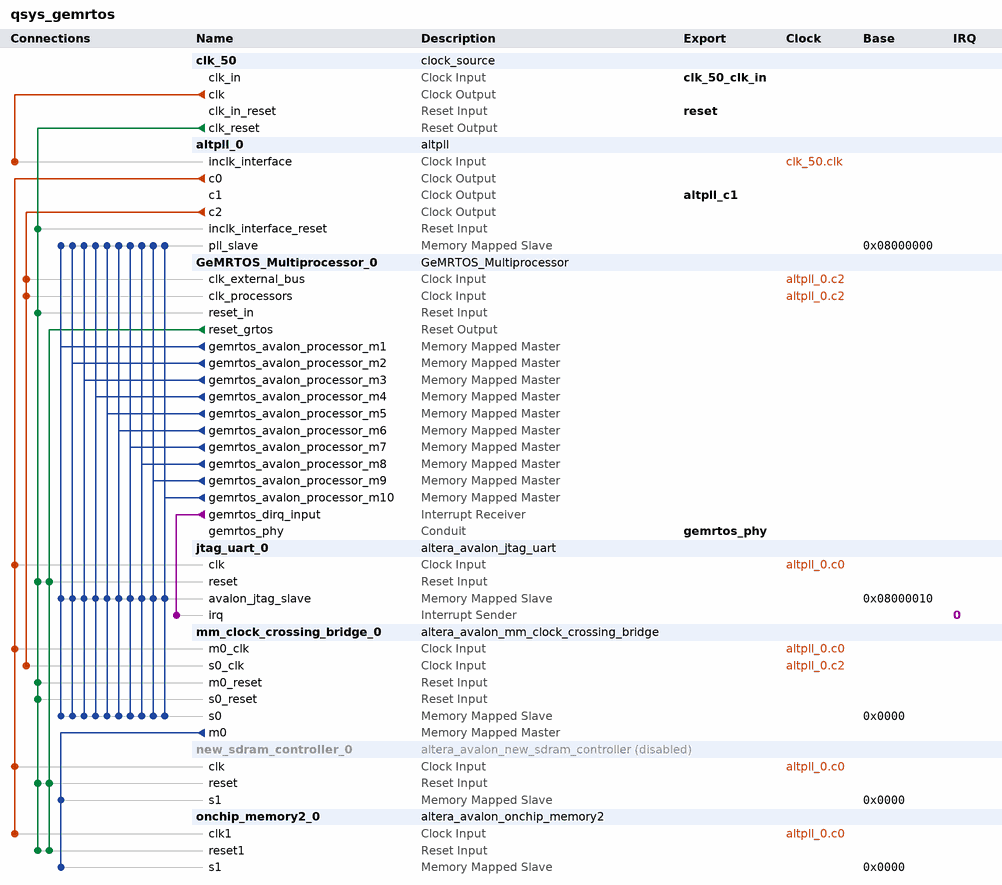
[diagram p0: system contents]
# Platform Designer (Qsys) system qsys_gemrtos, Cyclone IV E EP4CE115F29C7
# Parameters at their usual value, and those the tool derives, are not listed.
package require -exact qsys 23.1
create_system qsys_gemrtos
set_project_property DEVICE_FAMILY {Cyclone IV E}
set_project_property DEVICE EP4CE115F29C7

add_instance clk_50 clock_source 23.1
set_instance_parameter_value clk_50 clockFrequency 50000000

add_instance altpll_0 altpll 23.1
set_instance_parameter_value altpll_0 CLK0_DIVIDE_BY 1
set_instance_parameter_value altpll_0 CLK0_MULTIPLY_BY 2
set_instance_parameter_value altpll_0 CLK1_DIVIDE_BY 1
set_instance_parameter_value altpll_0 CLK1_DUTY_CYCLE 50
set_instance_parameter_value altpll_0 CLK1_MULTIPLY_BY 2
set_instance_parameter_value altpll_0 CLK1_PHASE_SHIFT -1806
set_instance_parameter_value altpll_0 CLK2_DIVIDE_BY 2
set_instance_parameter_value altpll_0 CLK2_DUTY_CYCLE 50
set_instance_parameter_value altpll_0 CLK2_MULTIPLY_BY 1
set_instance_parameter_value altpll_0 CLK2_PHASE_SHIFT 0
set_instance_parameter_value altpll_0 INCLK0_INPUT_FREQUENCY 20000
set_instance_parameter_value altpll_0 PORT_ARESET PORT_UNUSED
set_instance_parameter_value altpll_0 PORT_LOCKED PORT_UNUSED
set_instance_parameter_value altpll_0 PORT_clk1 PORT_USED
set_instance_parameter_value altpll_0 PORT_clk2 PORT_USED
set_instance_parameter_value altpll_0 PORT_clk3 PORT_UNUSED

add_instance GeMRTOS_Multiprocessor_0 GeMRTOS_Multiprocessor 1.0
set_instance_parameter_value GeMRTOS_Multiprocessor_0 BUS_WIDTH 28
set_instance_parameter_value GeMRTOS_Multiprocessor_0 CEFrequency 25000000
set_instance_parameter_value GeMRTOS_Multiprocessor_0 CFrequency 25000000
set_instance_parameter_value GeMRTOS_Multiprocessor_0 DEVICE_NAME EP4CE115F29C7
set_instance_parameter_value GeMRTOS_Multiprocessor_0 ENABLE_HPS_MAP_ACCESS false
set_instance_parameter_value GeMRTOS_Multiprocessor_0 GRTOS_INTERRUPTS 1
set_instance_parameter_value GeMRTOS_Multiprocessor_0 INCLUDE_JTAG_UART_PROCESSOR false
set_instance_parameter_value GeMRTOS_Multiprocessor_0 INCLUDE_JTAG_UART_STDDIO true
set_instance_parameter_value GeMRTOS_Multiprocessor_0 INCLUDE_JTAG_UART_STDERR true
set_instance_parameter_value GeMRTOS_Multiprocessor_0 INDEPENDENT_EXTERNAL_PROCESSOR_BUSES true
set_instance_parameter_value GeMRTOS_Multiprocessor_0 NProcessors 10
set_instance_parameter_value GeMRTOS_Multiprocessor_0 Processor_type {Nios V/m}
set_instance_parameter_value GeMRTOS_Multiprocessor_0 QSYS_PROJECT_FILE qsys_gemrtos
set_instance_parameter_value GeMRTOS_Multiprocessor_0 QUARTUS_PROJECT_FILE DE2_115
set_instance_parameter_value GeMRTOS_Multiprocessor_0 exceptionOffset 32
set_instance_parameter_value GeMRTOS_Multiprocessor_0 exceptionSlave onchip_memory2_0.s1
set_instance_parameter_value GeMRTOS_Multiprocessor_0 icache_size_parameter {512 Bytes}
set_instance_parameter_value GeMRTOS_Multiprocessor_0 pipelineArch_parameter False
set_instance_parameter_value GeMRTOS_Multiprocessor_0 resetOffset 0
set_instance_parameter_value GeMRTOS_Multiprocessor_0 resetSlave onchip_memory2_0.s1

add_instance jtag_uart_0 altera_avalon_jtag_uart 23.1
set_instance_parameter_value jtag_uart_0 simInteractiveOptions INTERACTIVE_ASCII_OUTPUT
set_instance_parameter_value jtag_uart_0 useRegistersForReadBuffer true
set_instance_parameter_value jtag_uart_0 useRegistersForWriteBuffer true

add_instance mm_clock_crossing_bridge_0 altera_avalon_mm_clock_crossing_bridge 23.1
set_instance_parameter_value mm_clock_crossing_bridge_0 ADDRESS_WIDTH 10
set_instance_parameter_value mm_clock_crossing_bridge_0 COMMAND_FIFO_DEPTH 4
set_instance_parameter_value mm_clock_crossing_bridge_0 DATA_WIDTH 32
set_instance_parameter_value mm_clock_crossing_bridge_0 MASTER_SYNC_DEPTH 2
set_instance_parameter_value mm_clock_crossing_bridge_0 MAX_BURST_SIZE 1
set_instance_parameter_value mm_clock_crossing_bridge_0 RESPONSE_FIFO_DEPTH 4
set_instance_parameter_value mm_clock_crossing_bridge_0 SLAVE_SYNC_DEPTH 2
set_instance_parameter_value mm_clock_crossing_bridge_0 USE_AUTO_ADDRESS_WIDTH 1

add_instance new_sdram_controller_0 altera_avalon_new_sdram_controller 13.0.1
set_instance_property new_sdram_controller_0 ENABLED false
set_instance_parameter_value new_sdram_controller_0 TAC 5.5
set_instance_parameter_value new_sdram_controller_0 TRCD 20.0
set_instance_parameter_value new_sdram_controller_0 TRP 20.0
set_instance_parameter_value new_sdram_controller_0 casLatency 3
set_instance_parameter_value new_sdram_controller_0 columnWidth 10
set_instance_parameter_value new_sdram_controller_0 dataWidth 32
set_instance_parameter_value new_sdram_controller_0 generateSimulationModel true
set_instance_parameter_value new_sdram_controller_0 model single_Micron_MT48LC4M32B2_7_chip
set_instance_parameter_value new_sdram_controller_0 numberOfBanks 4
set_instance_parameter_value new_sdram_controller_0 numberOfChipSelects 1
set_instance_parameter_value new_sdram_controller_0 powerUpDelay 200.0
set_instance_parameter_value new_sdram_controller_0 refreshPeriod 7.8125
set_instance_parameter_value new_sdram_controller_0 rowWidth 13

add_instance onchip_memory2_0 altera_avalon_onchip_memory2 23.1
set_instance_parameter_value onchip_memory2_0 dataWidth 32
set_instance_parameter_value onchip_memory2_0 dualPort false
set_instance_parameter_value onchip_memory2_0 initMemContent false
set_instance_parameter_value onchip_memory2_0 initializationFileName onchip_mem.hex
set_instance_parameter_value onchip_memory2_0 memorySize 344064

# connections
add_connection altpll_0.c0 jtag_uart_0.clk clock
add_connection altpll_0.c0 mm_clock_crossing_bridge_0.m0_clk clock
add_connection altpll_0.c0 new_sdram_controller_0.clk clock
add_connection altpll_0.c0 onchip_memory2_0.clk1 clock
add_connection altpll_0.c2 GeMRTOS_Multiprocessor_0.clk_external_bus clock
add_connection altpll_0.c2 GeMRTOS_Multiprocessor_0.clk_processors clock
add_connection altpll_0.c2 mm_clock_crossing_bridge_0.s0_clk clock
add_connection clk_50.clk altpll_0.inclk_interface clock
add_connection clk_50.clk_reset altpll_0.inclk_interface_reset reset
add_connection clk_50.clk_reset GeMRTOS_Multiprocessor_0.reset_in reset
add_connection clk_50.clk_reset jtag_uart_0.reset reset
add_connection clk_50.clk_reset mm_clock_crossing_bridge_0.m0_reset reset
add_connection clk_50.clk_reset mm_clock_crossing_bridge_0.s0_reset reset
add_connection clk_50.clk_reset new_sdram_controller_0.reset reset
add_connection clk_50.clk_reset onchip_memory2_0.reset1 reset
add_connection GeMRTOS_Multiprocessor_0.reset_grtos jtag_uart_0.reset reset
add_connection GeMRTOS_Multiprocessor_0.reset_grtos new_sdram_controller_0.reset reset
add_connection GeMRTOS_Multiprocessor_0.reset_grtos onchip_memory2_0.reset1 reset
add_connection GeMRTOS_Multiprocessor_0.gemrtos_avalon_processor_m1 altpll_0.pll_slave avalon
set_connection_parameter_value GeMRTOS_Multiprocessor_0.gemrtos_avalon_processor_m1/altpll_0.pll_slave baseAddress 0x08000000
add_connection GeMRTOS_Multiprocessor_0.gemrtos_avalon_processor_m1 jtag_uart_0.avalon_jtag_slave avalon
set_connection_parameter_value GeMRTOS_Multiprocessor_0.gemrtos_avalon_processor_m1/jtag_uart_0.avalon_jtag_slave baseAddress 0x08000010
add_connection GeMRTOS_Multiprocessor_0.gemrtos_avalon_processor_m1 mm_clock_crossing_bridge_0.s0 avalon
set_connection_parameter_value GeMRTOS_Multiprocessor_0.gemrtos_avalon_processor_m1/mm_clock_crossing_bridge_0.s0 baseAddress 0x0000
add_connection GeMRTOS_Multiprocessor_0.gemrtos_avalon_processor_m2 altpll_0.pll_slave avalon
set_connection_parameter_value GeMRTOS_Multiprocessor_0.gemrtos_avalon_processor_m2/altpll_0.pll_slave baseAddress 0x08000000
add_connection GeMRTOS_Multiprocessor_0.gemrtos_avalon_processor_m2 jtag_uart_0.avalon_jtag_slave avalon
set_connection_parameter_value GeMRTOS_Multiprocessor_0.gemrtos_avalon_processor_m2/jtag_uart_0.avalon_jtag_slave baseAddress 0x08000010
add_connection GeMRTOS_Multiprocessor_0.gemrtos_avalon_processor_m2 mm_clock_crossing_bridge_0.s0 avalon
set_connection_parameter_value GeMRTOS_Multiprocessor_0.gemrtos_avalon_processor_m2/mm_clock_crossing_bridge_0.s0 baseAddress 0x0000
add_connection GeMRTOS_Multiprocessor_0.gemrtos_avalon_processor_m3 altpll_0.pll_slave avalon
set_connection_parameter_value GeMRTOS_Multiprocessor_0.gemrtos_avalon_processor_m3/altpll_0.pll_slave baseAddress 0x08000000
add_connection GeMRTOS_Multiprocessor_0.gemrtos_avalon_processor_m3 jtag_uart_0.avalon_jtag_slave avalon
set_connection_parameter_value GeMRTOS_Multiprocessor_0.gemrtos_avalon_processor_m3/jtag_uart_0.avalon_jtag_slave baseAddress 0x08000010
add_connection GeMRTOS_Multiprocessor_0.gemrtos_avalon_processor_m3 mm_clock_crossing_bridge_0.s0 avalon
set_connection_parameter_value GeMRTOS_Multiprocessor_0.gemrtos_avalon_processor_m3/mm_clock_crossing_bridge_0.s0 baseAddress 0x0000
add_connection GeMRTOS_Multiprocessor_0.gemrtos_avalon_processor_m4 altpll_0.pll_slave avalon
set_connection_parameter_value GeMRTOS_Multiprocessor_0.gemrtos_avalon_processor_m4/altpll_0.pll_slave baseAddress 0x08000000
add_connection GeMRTOS_Multiprocessor_0.gemrtos_avalon_processor_m4 jtag_uart_0.avalon_jtag_slave avalon
set_connection_parameter_value GeMRTOS_Multiprocessor_0.gemrtos_avalon_processor_m4/jtag_uart_0.avalon_jtag_slave baseAddress 0x08000010
add_connection GeMRTOS_Multiprocessor_0.gemrtos_avalon_processor_m4 mm_clock_crossing_bridge_0.s0 avalon
set_connection_parameter_value GeMRTOS_Multiprocessor_0.gemrtos_avalon_processor_m4/mm_clock_crossing_bridge_0.s0 baseAddress 0x0000
add_connection GeMRTOS_Multiprocessor_0.gemrtos_avalon_processor_m5 altpll_0.pll_slave avalon
set_connection_parameter_value GeMRTOS_Multiprocessor_0.gemrtos_avalon_processor_m5/altpll_0.pll_slave baseAddress 0x08000000
add_connection GeMRTOS_Multiprocessor_0.gemrtos_avalon_processor_m5 jtag_uart_0.avalon_jtag_slave avalon
set_connection_parameter_value GeMRTOS_Multiprocessor_0.gemrtos_avalon_processor_m5/jtag_uart_0.avalon_jtag_slave baseAddress 0x08000010
add_connection GeMRTOS_Multiprocessor_0.gemrtos_avalon_processor_m5 mm_clock_crossing_bridge_0.s0 avalon
set_connection_parameter_value GeMRTOS_Multiprocessor_0.gemrtos_avalon_processor_m5/mm_clock_crossing_bridge_0.s0 baseAddress 0x0000
add_connection GeMRTOS_Multiprocessor_0.gemrtos_avalon_processor_m6 altpll_0.pll_slave avalon
set_connection_parameter_value GeMRTOS_Multiprocessor_0.gemrtos_avalon_processor_m6/altpll_0.pll_slave baseAddress 0x08000000
add_connection GeMRTOS_Multiprocessor_0.gemrtos_avalon_processor_m6 jtag_uart_0.avalon_jtag_slave avalon
set_connection_parameter_value GeMRTOS_Multiprocessor_0.gemrtos_avalon_processor_m6/jtag_uart_0.avalon_jtag_slave baseAddress 0x08000010
add_connection GeMRTOS_Multiprocessor_0.gemrtos_avalon_processor_m6 mm_clock_crossing_bridge_0.s0 avalon
set_connection_parameter_value GeMRTOS_Multiprocessor_0.gemrtos_avalon_processor_m6/mm_clock_crossing_bridge_0.s0 baseAddress 0x0000
add_connection GeMRTOS_Multiprocessor_0.gemrtos_avalon_processor_m7 altpll_0.pll_slave avalon
set_connection_parameter_value GeMRTOS_Multiprocessor_0.gemrtos_avalon_processor_m7/altpll_0.pll_slave baseAddress 0x08000000
add_connection GeMRTOS_Multiprocessor_0.gemrtos_avalon_processor_m7 jtag_uart_0.avalon_jtag_slave avalon
set_connection_parameter_value GeMRTOS_Multiprocessor_0.gemrtos_avalon_processor_m7/jtag_uart_0.avalon_jtag_slave baseAddress 0x08000010
add_connection GeMRTOS_Multiprocessor_0.gemrtos_avalon_processor_m7 mm_clock_crossing_bridge_0.s0 avalon
set_connection_parameter_value GeMRTOS_Multiprocessor_0.gemrtos_avalon_processor_m7/mm_clock_crossing_bridge_0.s0 baseAddress 0x0000
add_connection GeMRTOS_Multiprocessor_0.gemrtos_avalon_processor_m8 altpll_0.pll_slave avalon
set_connection_parameter_value GeMRTOS_Multiprocessor_0.gemrtos_avalon_processor_m8/altpll_0.pll_slave baseAddress 0x08000000
add_connection GeMRTOS_Multiprocessor_0.gemrtos_avalon_processor_m8 jtag_uart_0.avalon_jtag_slave avalon
set_connection_parameter_value GeMRTOS_Multiprocessor_0.gemrtos_avalon_processor_m8/jtag_uart_0.avalon_jtag_slave baseAddress 0x08000010
add_connection GeMRTOS_Multiprocessor_0.gemrtos_avalon_processor_m8 mm_clock_crossing_bridge_0.s0 avalon
set_connection_parameter_value GeMRTOS_Multiprocessor_0.gemrtos_avalon_processor_m8/mm_clock_crossing_bridge_0.s0 baseAddress 0x0000
add_connection GeMRTOS_Multiprocessor_0.gemrtos_avalon_processor_m9 altpll_0.pll_slave avalon
set_connection_parameter_value GeMRTOS_Multiprocessor_0.gemrtos_avalon_processor_m9/altpll_0.pll_slave baseAddress 0x08000000
add_connection GeMRTOS_Multiprocessor_0.gemrtos_avalon_processor_m9 jtag_uart_0.avalon_jtag_slave avalon
set_connection_parameter_value GeMRTOS_Multiprocessor_0.gemrtos_avalon_processor_m9/jtag_uart_0.avalon_jtag_slave baseAddress 0x08000010
add_connection GeMRTOS_Multiprocessor_0.gemrtos_avalon_processor_m9 mm_clock_crossing_bridge_0.s0 avalon
set_connection_parameter_value GeMRTOS_Multiprocessor_0.gemrtos_avalon_processor_m9/mm_clock_crossing_bridge_0.s0 baseAddress 0x0000
add_connection GeMRTOS_Multiprocessor_0.gemrtos_avalon_processor_m10 altpll_0.pll_slave avalon
set_connection_parameter_value GeMRTOS_Multiprocessor_0.gemrtos_avalon_processor_m10/altpll_0.pll_slave baseAddress 0x08000000
add_connection GeMRTOS_Multiprocessor_0.gemrtos_avalon_processor_m10 jtag_uart_0.avalon_jtag_slave avalon
set_connection_parameter_value GeMRTOS_Multiprocessor_0.gemrtos_avalon_processor_m10/jtag_uart_0.avalon_jtag_slave baseAddress 0x08000010
add_connection GeMRTOS_Multiprocessor_0.gemrtos_avalon_processor_m10 mm_clock_crossing_bridge_0.s0 avalon
set_connection_parameter_value GeMRTOS_Multiprocessor_0.gemrtos_avalon_processor_m10/mm_clock_crossing_bridge_0.s0 baseAddress 0x0000
add_connection mm_clock_crossing_bridge_0.m0 new_sdram_controller_0.s1 avalon
set_connection_parameter_value mm_clock_crossing_bridge_0.m0/new_sdram_controller_0.s1 baseAddress 0x0000
add_connection mm_clock_crossing_bridge_0.m0 onchip_memory2_0.s1 avalon
set_connection_parameter_value mm_clock_crossing_bridge_0.m0/onchip_memory2_0.s1 baseAddress 0x0000
add_connection GeMRTOS_Multiprocessor_0.gemrtos_dirq_input jtag_uart_0.irq interrupt
set_connection_parameter_value GeMRTOS_Multiprocessor_0.gemrtos_dirq_input/jtag_uart_0.irq irqNumber 0

# exported interfaces
add_interface altpll_c1 clock source
set_interface_property altpll_c1 EXPORT_OF altpll_0.c1
add_interface clk_50_clk_in clock sink
set_interface_property clk_50_clk_in EXPORT_OF clk_50.clk_in
add_interface gemrtos_phy conduit end
set_interface_property gemrtos_phy EXPORT_OF GeMRTOS_Multiprocessor_0.gemrtos_phy
add_interface reset reset sink
set_interface_property reset EXPORT_OF clk_50.clk_in_reset

set_interconnect_requirement {$system} qsys_mm.clockCrossingAdapter HANDSHAKE
set_interconnect_requirement {$system} qsys_mm.maxAdditionalLatency 1

save_system qsys_gemrtos.qsys
